# Altium schematic sheet SD_Card.SchDoc
size A4
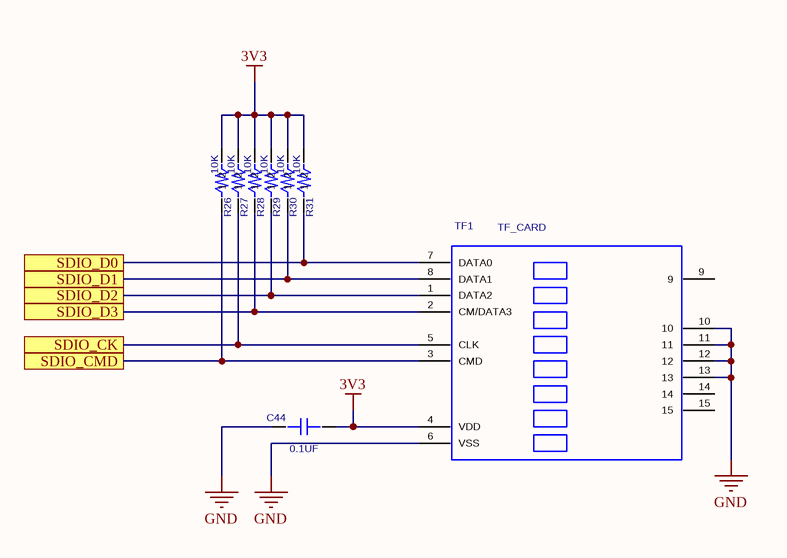
[diagram p0: SD_Card.SchDoc]

## Parts
C44  value 0.1UF  [CAP_0603_FIRE]  (hidden comment: CAP_0.1UF_0603_FIRE)
R26  value 10K  [RES_0603_FIRE]  (hidden comment: RES_10K_0603_FIRE)
R27  value 10K  [RES_0603_FIRE]  (hidden comment: RES_10K_0603_FIRE)
R28  value 10K  [RES_0603_FIRE]  (hidden comment: RES_10K_0603_FIRE)
R29  value 10K  [RES_0603_FIRE]  (hidden comment: RES_10K_0603_FIRE)
R30  value 10K  [RES_0603_FIRE]  (hidden comment: RES_10K_0603_FIRE)
R31  value 10K  [RES_0603_FIRE]  (hidden comment: RES_10K_0603_FIRE)
TF1  TF_CARD  [TF_CARD]

## Ports
SDIO_CK, SDIO_CMD, SDIO_D0, SDIO_D1, SDIO_D2, SDIO_D3

## Nets
3V3: C44.1 R26.2 R27.2 R28.2 R29.2 R30.2 R31.2 TF1.4(VDD)
GND: C44.2 TF1.6(VSS) TF1.10 TF1.11 TF1.12 TF1.13
SDIO_CK: R27.1 TF1.5(CLK) ; port SDIO_CK
SDIO_CMD: R26.1 TF1.3(CMD) ; port SDIO_CMD
SDIO_D0: R31.1 TF1.7(DATA0) ; port SDIO_D0
SDIO_D1: R30.1 TF1.8(DATA1) ; port SDIO_D1
SDIO_D2: R29.1 TF1.1(DATA2) ; port SDIO_D2
SDIO_D3: R28.1 TF1.2(CM/DATA3) ; port SDIO_D3

Not connected (* = marked no-connect by the designer): TF1 9 14 15

## Library data of the parts
C44 = CAP_0.1UF_0603_FIRE: SURFACE MOUNT CAPACITOR 0.031 X 0.061 INCHES; PCB DECAL: CAP_0603_FIRE
R26-R31 = RES_10K_0603_FIRE: SURFACE MOUNT RESISTOR 0.031 X 0.061 INCHES, 1/10W; Assembly: SMD; PCB DECAL: RES_0603_FIRE
TF1 = TF_CARD: Manufacturer #1 PN: MicroSD座/手机; PCB DECAL: TF_CARD